# EasyEDA Pro project FKM3.epro, board PCB9
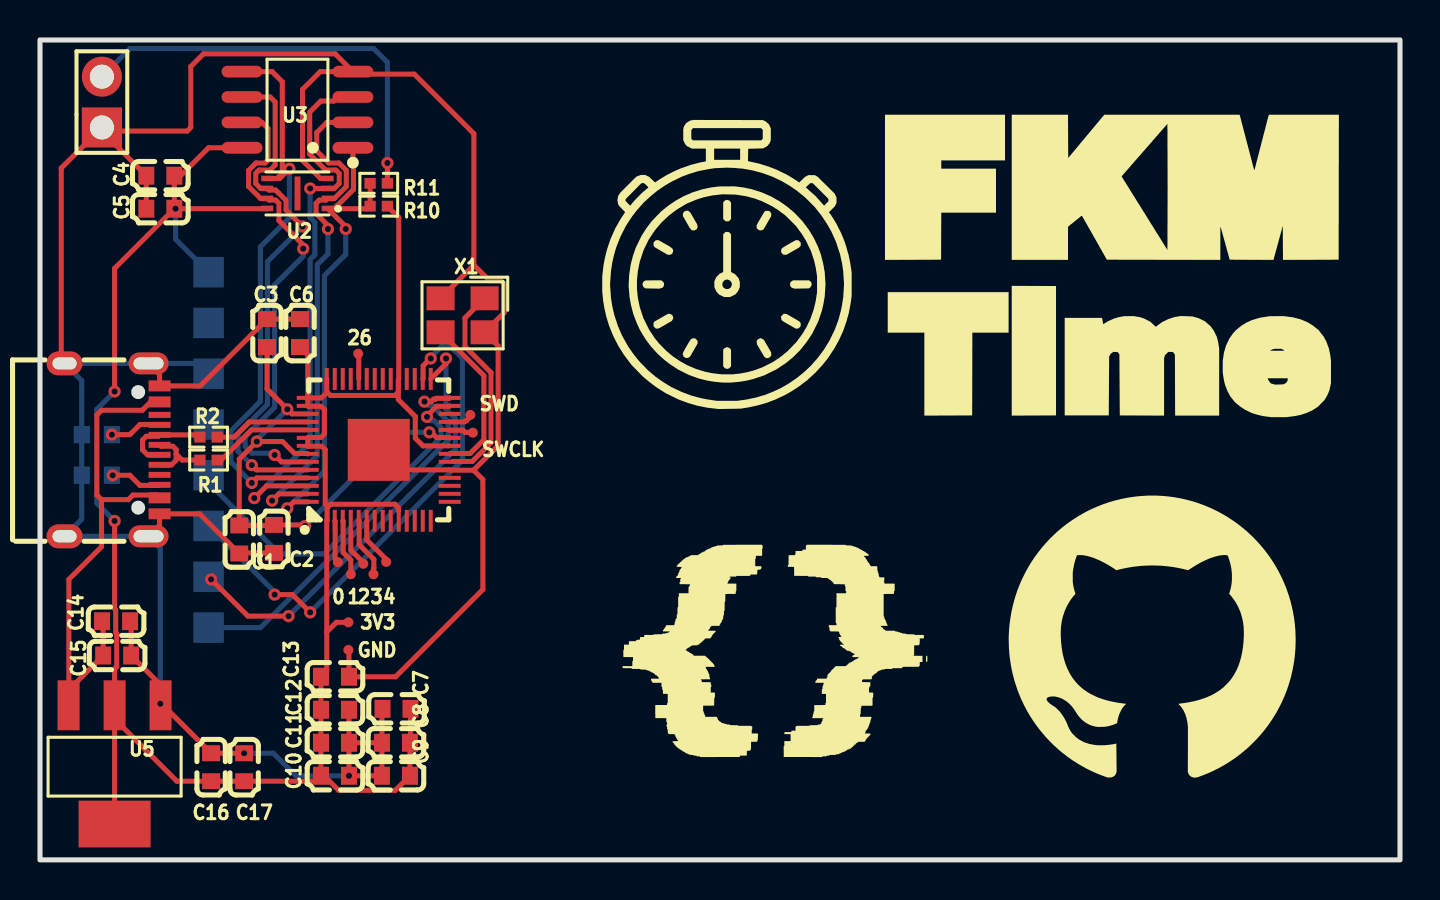
[diagram p15: board, top side]
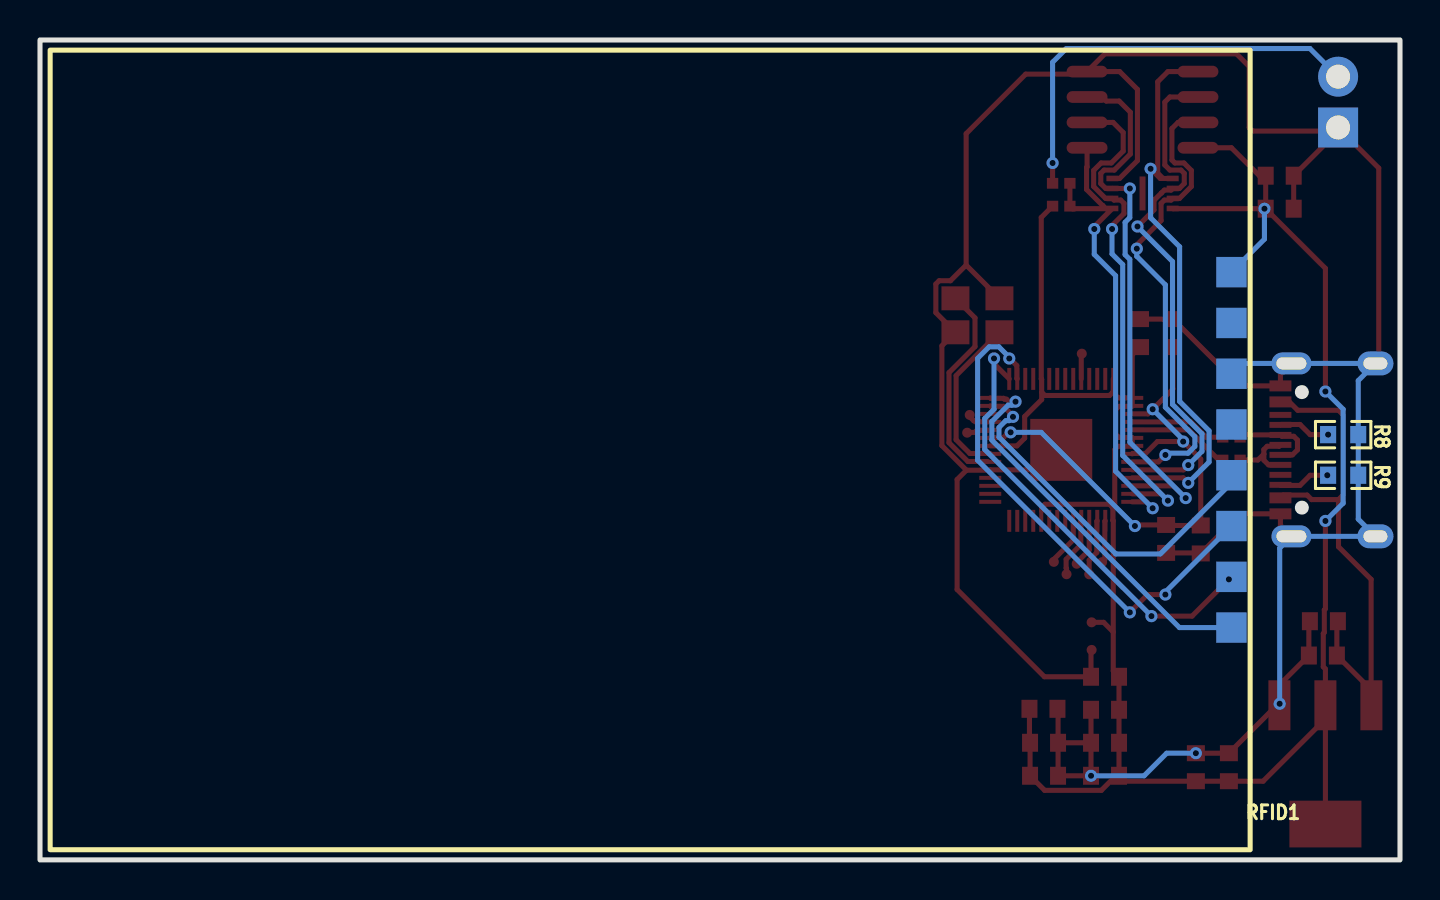
[diagram p16: board, bottom side, seen from below]

Outline 68 x 41.02 mm; copper layers: Top Layer, Bottom Layer. Coordinates in mm from the lower left corner of the outline.
Outline path: rectangle 0,41.02 68,0
Stack: Top Layer 0.035mm / Dielectric1 1.51mm FR4 er 4.5 / Bottom Layer 0.035mm

## Design rules (mm)
template: JLCPCB Capability(Two Layers Board)
spacing copperThickness1oz (default): track to track 0.102, other pairs 0.152 to 0.3
spacing copperThickness2oz: track to track 0.203, other pairs 0.152 to 0.3
track width copperThickness1oz (default): min 0.127, default 0.254, max 2.54
track width copperThickness2oz: min 0.203, default 0.254, max 2.54
differential pair differentialPair (default): width min 0.127, default 0.254, max 2.54; gap min 0.152, default 0.152
via viaSize (default): diameter min 0.5, default 0.61, max 10; hole min 0.3, default 0.305, max 6.3

## Placement (name value [footprint] x y rotation side)
0  -  [Test-Point-0.5mm]  14.89 14.89 0 top
1  -  [Test-Point-0.5mm]  15.54 14.29 0 top
2  -  [Test-Point-0.5mm]  16.17 14.81 0 top
3  -  [Test-Point-0.5mm]  16.67 14.29 0 top
3V3  -  [Test-Point-0.5mm]  15.42 11.88 0 top
4  -  [Test-Point-0.5mm]  17.31 14.91 0 top
26  -  [Test-Point-0.5mm]  15.91 25.32 0 top
C1  100nF  [C0603]  9.96 16.03 270 top
C2  100nF  [C0603]  11.69 16.06 270 top
C3  1uF  [C0603]  11.35 26.35 90 top
C4  100nF  [C0603]  6.02 34.23 0 top
C5  100nF  [C0603]  6.02 32.58 0 top
C6  1uF  [C0603]  13 26.35 270 top
C7  100nF  [C0603]  17.83 7.56 180 top
C8  100nF  [C0603]  17.8 5.86 180 top
C9  100nF  [C0603]  17.8 4.21 180 top
C10  100nF  [C0603]  14.75 4.21 0 top
C11  100nF  [C0603]  14.75 5.86 0 top
C12  100nF  [C0603]  14.75 7.51 0 top
C13  100nF  [C0603]  14.75 9.16 0 top
C14  100nF  [C0603]  3.81 11.94 180 top
C15  10uF  [C0603]  3.86 10.22 180 top
C16  100nF  [C0603]  8.56 4.64 270 top
C17  10uF  [C0603]  10.21 4.64 270 top
GND  -  [Test-Point-0.5mm]  15.42 10.5 0 top
H1  PZ254V-11-02P  [HDR-TH_2P-P2.54-V-M]  3.09 37.91 90 top
R1  27.4Ω  [R0402]  8.43 20 180 top
R2  27.4Ω  [R0402]  8.43 21.15 180 top
R8  5100  [R0603]  2.84 21.27 0 bottom
R9  5100  [R0603]  2.84 19.24 0 bottom
R10  1kΩ  [R0402]  16.94 32.7 0 top
R11  1kΩ  [R0402]  16.94 33.85 180 top
RFID1  -  [RFID-RC522-Board]  12.75 58.99 0 bottom
SWCLK  -  [Test-Point-0.5mm]  21.64 21.37 0 top
SWD  -  [Test-Point-0.5mm]  21.51 22.26 0 top
U1  RP2040  [LQFN-56_L7.0-W7.0-P0.4-EP]  16.94 20.51 90 top
U2  W25Q16JVUXIQ  [USON-8_L3.0-W2.0-P0.50-BL-EP]  12.87 33.34 90 top
U3  AT25SF041B-SSHD-T  [SOIC-8_L4.9-W3.9-P1.27-LS6.0-BL]  12.87 37.53 90 top
U5  AMS1117-3.3  [SOT-223-3_L6.5-W3.4-P2.30-LS7.0-BR]  3.73 4.76 90 top
USB1  TYPE-C 16PIN 2MD(073)  [USB-C-SMD_TYPE-C-6PIN-2MD-073]  3.6 20.51 270 top
X1  12MHz  [CRYSTAL-SMD_4P-L3.2-W2.5-BL]  21.13 27.24 180 top

## Footprints (pads in the part's own frame, mm; a bottom-side part is the same pattern mirrored in y, then rotated)
C0603
  rect 0.8x0.9 smd: 1(-0.7,0) 2(0.7,0)
CRYSTAL-SMD_4P-L3.2-W2.5-BL
  rect 1.4x1.2 smd: 1(-1.1,-0.85) 2(1.1,-0.85) 3(1.1,0.85) 4(-1.1,0.85)
HDR-TH_2P-P2.54-V-M
  rect 2x2 hole 1.2: 1(-1.27,0)
  round 2 hole 1.2: 2(1.27,0)
LQFN-56_L7.0-W7.0-P0.4-EP
  rect 1.1x0.2 smd: 1(-3.55,2.6) 2(-3.55,2.2) 3(-3.55,1.8) 4(-3.55,1.4) 5(-3.55,1) 6(-3.55,0.6) 7(-3.55,0.2) 8(-3.55,-0.2) 9(-3.55,-0.6) 10(-3.55,-1) 11(-3.55,-1.4) 12(-3.55,-1.8) 13(-3.55,-2.2) 14(-3.55,-2.6) 29(3.55,-2.6) 30(3.55,-2.2) 31(3.55,-1.8) 32(3.55,-1.4) 33(3.55,-1) 34(3.55,-0.6) 35(3.55,-0.2) 36(3.55,0.2) 37(3.55,0.6) 38(3.55,1) 39(3.55,1.4) 40(3.55,1.8) 41(3.55,2.2) 42(3.55,2.6)
  rect 0.2x1.1 smd: 15(-2.6,-3.55) 16(-2.2,-3.55) 17(-1.8,-3.55) 18(-1.4,-3.55) 19(-1,-3.55) 20(-0.6,-3.55) 21(-0.2,-3.55) 22(0.2,-3.55) 23(0.6,-3.55) 24(1,-3.55) 25(1.4,-3.55) 26(1.8,-3.55) 27(2.2,-3.55) 28(2.6,-3.55) 43(2.6,3.55) 44(2.2,3.55) 45(1.8,3.55) 46(1.4,3.55) 47(1,3.55) 48(0.6,3.55) 49(0.2,3.55) 50(-0.2,3.55) 51(-0.6,3.55) 52(-1,3.55) 53(-1.4,3.55) 54(-1.8,3.55) 55(-2.2,3.55) 56(-2.6,3.55)
  rect 3.1x3.1 smd: 57(0,0)
R0402
  rect 0.566x0.54 smd: 1(-0.433,0) 2(0.433,0)
R0603
  rect 0.806x0.864 smd: 1(-0.753,0) 2(0.753,0)
RFID-RC522-Board
  rect 1.524x1.524 smd: 1(-4.318,47.371) 2(-4.318,44.831) 3(-4.318,42.291) 4(-4.318,39.751) 5(-4.318,37.211) 6(-4.318,34.671) 7(-4.318,32.131) 8(-4.318,29.591)
SOIC-8_L4.9-W3.9-P1.27-LS6.0-BL
  oval 0.588x2.045 smd: 1(-1.905,-2.772) 2(-0.635,-2.772) 3(0.635,-2.772) 4(1.905,-2.772) 5(1.905,2.772) 6(0.635,2.772) 7(-0.635,2.772) 8(-1.905,2.772)
SOT-223-3_L6.5-W3.4-P2.30-LS7.0-BR
  rect 2.5x1.1 smd: 1(2.97,-2.3) 2(2.97,0) 3(2.97,2.3)
  rect 2.34x3.6 smd: 4(-2.97,0)
Test-Point-0.5mm
  round 0.5 smd: 1(0,0)
USB-C-SMD_TYPE-C-6PIN-2MD-073
  rect 0.55x1.1 smd: 1(-3.2,2.375) 2(-2.4,2.375) 11(2.4,2.375) 12(3.2,2.375)
  rect 0.3x1.1 smd: 3(-1.75,2.375) 4(-1.25,2.375) 5(-0.75,2.375) 6(-0.25,2.375) 7(0.25,2.375) 8(0.75,2.375) 9(1.25,2.375) 10(1.75,2.375)
  oval 1.1x2 hole 0.6x1.5: 13(-4.325,1.825) 14(4.325,1.825)
  oval 1.2x1.8 hole 0.6x1.2: 13(-4.325,-2.375) 14(4.325,-2.375)
USON-8_L3.0-W2.0-P0.50-BL-EP
  rect 0.28x0.6 smd: 1(-0.75,-1.508) 2(-0.25,-1.508) 3(0.25,-1.508) 4(0.75,-1.508) 5(0.75,1.508) 6(0.25,1.508) 7(-0.25,1.508) 8(-0.75,1.508)
  rect 1.7x0.3 smd: 9(0,0)

## Nets
+1V1: C1.1 C2.1 C3.1 U1.23 U1.45 U1.50
+3V3: 3V3.1 C4.2 C5.2 C6.2 C7.1 C8.1 C9.1 C10.1 C11.1 C12.1 C13.1 C16.2 C17.2 R10.2 RFID1.8 U1.1 U1.10 U1.22 U1.33 U1.42 U1.43 U1.44 U1.48 U1.49 U2.8 U3.8 U5.2 U5.4
GND: C1.2 C2.2 C3.2 C4.1 C5.1 C6.1 C7.2 C8.2 C9.2 C10.2 C11.2 C12.2 C13.2 C14.1 C15.1 C16.1 C17.1 GND.1 H1.1 R8.1 R9.1 RFID1.6 U1.19 U1.57 U2.4 U3.4 U5.1 USB1.1 USB1.12 USB1.13 USB1.14 X1.2 X1.4
GPIO0: 0.1 U1.2
GPIO1: 1.1 U1.3
GPIO2: 2.1 U1.4
GPIO3: 3.1 U1.5
GPIO4: 4.1 U1.6
GPIO26: 26.1 U1.38
IRQ: U1.31
QSPI_SCLK: U1.52 U2.6 U3.6
QSPI_SD0: U1.53 U2.5 U3.5
QSPI_SD1: U1.55 U2.2 U3.2
QSPI_SD2: U1.54 U2.3 U3.3
QSPI_SD3: U1.51 U2.7 U3.7
QSPI_SS: R10.1 R11.2 U1.56 U2.1 U3.1
SPI_CS: RFID1.1 U1.28
SPI_MISO: RFID1.4 U1.27
SPI_MOSI: RFID1.3 U1.30
SPI_SCK: RFID1.2 U1.29
SWCLK: SWCLK.1 U1.24
SWD: SWD.1 U1.25
USB_DM: R2.2 USB1.5 USB1.7
USB_DP: R1.2 USB1.6 USB1.8
VUSB: C14.2 C15.2 U5.3 USB1.2 USB1.11
XIN: U1.20 X1.1
XOUT: U1.21 X1.3
$1N1062: R1.1 U1.47
$1N1101: R2.1 U1.46
$1N1888: R8.2 USB1.4
$1N1892: R9.2 USB1.10
$1N2947: H1.2 R11.1

Pads without a net: RFID1 5 7; U1 7 8 9 11 12 13 14 15 16 17 18 26 32 34 35 36 37 39 40 41; U2 9; USB1 3 9

## Via types
v1: diameter 0.61, hole 0.305, Top Layer to Bottom Layer, 33 vias

## Routing (per net, layer and track width the routed paths; a pad name or vN(x,y) marks a point on that pad's centre or on a via; arc(x,y) is an arc through that point)
+1V1: length 26.9
  Top Layer w0.254: v1(19.47,21.39) 19.57,21.39 19.82,21.13 20.47,21.13 U1.23 ; C3.1 11.35,23.56 v1(12.37,22.54) 12.6,22.31 U1.45 ; v1(13.25,16.7) 13.2,16.76 C2.1 11.67,16.73 C1.1 9.96,20.05 v1(10.84,20.93) 12.13,20.93 12.72,20.33 13.37,20.33 U1.50
  Bottom Layer w0.254: v1(10.84,20.93) 10.84,21.02 v1(12.37,22.54) ; v1(19.47,21.39) 17.94,21.39 v1(13.25,16.7)
+3V3: length 115.1
  Top Layer w0.254: 17.92,23.4 17.75,23.23 14.52,23.23 14.38,23.37 14.34,23.37 ; 17.92,23.4 17.92,24.04 U1.33 17.94,32.14 R10.2 ; 17.92,23.4 17.92,23.03 18.77,22.18 18.77,21.09 19.15,20.71 U1.22 ; 14.34,23.37 14.34,24.06 ; 14.34,23.37 14.08,23.11 U1.43 ; v1(6.78,32.58) 11.35,32.58 U2.8 ; v1(6.78,32.58) C5.2 3.73,29.59 v1(3.73,23.43) ; v1(6.78,32.58) 6.72,32.64 C4.2 7.03,34.23 8.43,35.62 U3.8 ; C6.2 13.39,25.27 U1.43 ; 17.92,17.46 17.92,17.63 17.75,17.79 14.52,17.79 14.4,17.67 ; C7.1 18.53,5.89 C8.1 C9.1 17.77,3.48 14.93,3.48 14.2,4.21 C10.1 ; 3.73,1.79 3.73,7.05 6.84,3.94 C16.2 C17.2 13.78,3.94 C10.1 ; v1(3.73,16.95) 3.73,12.56 3.78,12.51 3.78,11.37 3.84,11.32 3.84,9.66 3.73,9.55 U5.2 ; C10.1 C11.1 C12.1 C13.1 14.34,9.45 14.34,11.4 ; U1.43 U1.44 13.41,22.69 14.05,22.69 14.22,22.53 14.22,21.3 14.05,21.13 13.41,21.13 U1.48 U1.49 13.41,20.69 14.09,20.69 14.26,20.52 14.26,17.8 14.4,17.67 ; 14.4,17.67 14.36,17.63 14.36,16.98 14.34,16.96 14.34,11.4 ; 14.34,11.4 14.82,11.88 3V3.1
  Bottom Layer w0.254: v1(3.73,23.43) 2.84,22.54 2.84,17.84 v1(3.73,16.95) ; v1(6.78,32.58) 6.78,31.05 RFID1.8
GND: length 164.9
  Top Layer w0.254: 21.68,19.49 22.91,20.72 22.91,25.71 X1.4 22.23,26.4 23.21,27.38 23.21,28.81 23.04,28.97 22.48,28.97 21.69,29.76 ; 21.68,19.49 22.15,19.03 22.15,13.53 17.78,9.16 C13.2 15.45,10.53 GND.1 ; 21.68,19.49 20.5,19.49 U1.19 17.94,19.51 U1.57 ; H1.1 3.09,36.45 C4.1 C5.1 ; H1.1 1.06,34.61 1.06,25 USB1.13 ; H1.1 3.27,36.46 7.36,36.46 7.54,36.64 7.54,39.69 8.17,40.32 14.76,40.32 U3.4 ; C8.2 17.1,7.49 17.08,7.51 C7.2 ; C8.2 C9.2 15.69,4.21 15.45,4.45 C11.2 ; C8.2 C11.2 ; C12.2 C11.2 ; C6.1 C3.2 8.01,23.71 USB1.1 5.98,24.29 USB1.13 ; U3.4 15.77,39.31 18.72,39.31 21.69,36.33 21.69,29.76 ; U3.4 14.02,39.43 13.13,38.54 13.13,34.98 14.02,34.09 U2.4 ; C2.2 9.99,15.36 C1.2 7.98,17.31 USB1.12 5.98,16.74 USB1.14 ; 21.69,29.76 X1.2 ; v1(10.21,5.34) C16.1 6.16,7.73 U5.1 6.03,8.75 C15.1 4.56,11.89 C14.1
  Bottom Layer w0.254: v1(10.21,5.34) 11.67,5.34 12.79,4.21 v1(15.45,4.21) ; v1(6.02,7.81) 6.02,15.6 USB1.14 USB1.14 2.09,17.05 R9.1 R8.1 2.09,23.98 USB1.13 USB1.13 7.91,24.84 RFID1.6
GPIO0: length 2.1
  Top Layer w0.254: U1.2 14.76,16.94 14.76,15.03 0.1
GPIO1: length 2.8
  Top Layer w0.254: 1.1 15.54,15 15.16,15.38 15.16,16.94 U1.3
GPIO2: length 1.9
  Top Layer w0.254: 15.54,16.45 15.54,15.5 16.17,14.88 2.1
GPIO3: length 3
  Top Layer w0.254: U1.5 15.96,16.94 15.96,15.77 16.69,15.03 16.69,14.59 16.67,14.57 3.1
GPIO4: length 2.3
  Top Layer w0.254: 16.34,16.96 16.34,16.01 17.31,15.04
GPIO26: length 1.3
  Top Layer w0.254: U1.38 15.94,25.3 26.1
QSPI_SCLK: length 26.5
  Top Layer w0.254: U1.52 10.83,19.51 v1(10.59,19.75) ; U3.6 11.5,38.16 11.76,37.91 11.76,34.76 11.5,34.51 10.95,34.51 10.79,34.34 10.79,33.83 11.03,33.59 U2.6 11.45,33.51 11.78,33.51 11.93,33.36 11.93,33.36 12.3,32.99 12.3,32.51 v1(13.13,31.69)
  Bottom Layer w0.254: v1(13.13,31.69) 11.38,29.93 11.38,22.79 9.9,21.32 9.9,20.43 v1(10.59,19.75)
QSPI_SD0: length 28.7
  Top Layer w0.254: 11.85,34.09 12.11,34.36 12.11,38.92 11.6,39.43 U3.5 ; 11.85,34.09 U2.5 ; 11.85,34.09 11.99,34.09 v1(12.47,34.57) ; v1(10.59,18.86) 10.84,19.11 U1.53
  Bottom Layer w0.254: v1(10.59,18.86) 9.55,19.9 9.55,21.46 11.02,22.94 11.02,30.67 12.47,32.12 v1(12.47,34.57)
QSPI_SD1: length 25.7
  Top Layer w0.254: U3.2 14.35,36.89 13.84,36.39 13.84,35.46 14.43,34.86 14.94,34.86 15.32,34.49 15.32,33.68 14.72,33.09 U2.2 14.3,33.01 13.97,33.01 13.8,32.84 13.8,32.33 14.38,31.75 14.38,31.58 v1(14.4,31.56) ; v1(11.6,17.97) 11.94,18.31 U1.55
  Bottom Layer w0.254: v1(11.6,17.97) 13.86,20.23 13.86,29.78 14.4,30.31 v1(14.4,31.56)
QSPI_SD2: length 28.3
  Top Layer w0.254: v1(10.72,18.1) 11.33,18.71 U1.54 ; U3.3 14.89,38.16 14.69,37.96 14.04,37.96 13.48,37.4 13.48,35.31 14.29,34.51 14.8,34.51 14.96,34.34 14.96,33.83 14.72,33.59 U2.3 v1(13.51,33.59)
  Bottom Layer w0.254: v1(10.72,18.1) 13.51,20.89 13.51,30.04 13.74,30.28 13.74,31.9 13.51,32.13 v1(13.51,33.59)
QSPI_SD3: length 24.2
  Top Layer w0.254: v1(13.16,30.58) 13.16,30.77 11.95,31.98 11.95,32.84 11.78,33.01 11.45,33.01 U2.7 11.03,33.09 10.43,33.68 10.43,34.49 10.8,34.86 11.26,34.86 11.4,35.01 11.4,36.59 11.1,36.89 U3.7 ; v1(11.73,20.26) 12.08,19.91 U1.51
  Bottom Layer w0.254: v1(11.73,20.26) 11.64,20.34 10.6,20.34 10.26,20.68 10.26,21.17 11.73,22.64 11.73,28.77 13.16,30.19 v1(13.16,30.58)
QSPI_SS: length 24.5
  Top Layer w0.254: 14.7,32.58 16.38,32.58 R10.1 R11.2 ; 14.7,32.58 14.86,32.73 14.87,32.73 15.67,33.54 15.67,34.64 15.65,34.66 U3.1 ; 14.7,32.58 14.39,32.58 ; 14.39,32.58 15.29,31.68 v1(15.29,31.56) ; 14.39,32.58 U2.1 ; U1.56 12.69,17.91 v1(12.37,17.59)
  Bottom Layer w0.254: v1(12.37,17.59) 14.22,19.44 14.22,29.22 15.29,30.29 v1(15.29,31.56)
SPI_CS: length 19.7
  Top Layer w0.254: v1(19.22,22.92) 19.55,22.92 19.68,23.05 19.78,23.05 19.82,23.09 20.47,23.09 U1.28
  Bottom Layer w0.254: RFID1.1 11.03,11.62 20.41,21 20.41,21.93 19.59,22.75 19.4,22.75 v1(19.22,22.92)
SPI_MISO: length 18.7
  Top Layer w0.254: v1(19.35,22.16) 19.35,22.22 19.82,22.69 20.47,22.69 U1.27
  Bottom Layer w0.254: RFID1.4 8.43,18.86 11.98,15.3 14.21,15.3 20.05,21.15 20.05,21.63 19.71,21.97 19.54,21.97 v1(19.35,22.16)
SPI_MOSI: length 26.1
  Top Layer w0.254: v1(19.54,25.08) 19.52,25.08 19.16,24.73 19.16,24.08 U1.30 ; v1(13.51,12.38) 12.62,13.27 v1(11.73,13.27)
  Bottom Layer w0.254: v1(11.73,13.27) 11.73,13.4 RFID1.3 ; v1(13.51,12.38) 21.12,19.99 21.12,25.09 20.54,25.67 20.06,25.67 19.54,25.15 v1(19.54,25.08)
SPI_SCK: length 22.5
  Top Layer w0.254: v1(12.43,12.19) 10.4,12.19 v1(8.56,14.03) ; U1.29 20.3,24.82 v1(20.3,25.08)
  Bottom Layer w0.254: v1(12.43,12.19) 20.76,20.53 20.76,22.08 20.3,22.54 v1(20.3,25.08)
SWCLK: length 1.1
  Top Layer w0.254: 21.51,21.38 21.26,21.38 21.15,21.49 20.51,21.49 U1.24
SWD: length 1.1
  Top Layer w0.254: U1.25 21.21,21.91 21.27,21.97 21.32,21.97 21.51,22.16
USB_DM: length 4.5
  Top Layer w0.254: R2.2 7.88,21.26 USB1.5 5.91,21.19 5.31,21.19 5.13,21 5.13,20.51 5.38,20.26 USB1.7
USB_DP: length 3.7
  Top Layer w0.254: 6.81,20.3 6.81,20.53 6.64,20.69 6.05,20.69 USB1.6 ; 6.81,20.3 6.81,20 6.57,19.76 USB1.8 ; 6.81,20.3 7.11,20 R1.2
VUSB: length 25.9
  Top Layer w0.254: USB1.2 5.53,22.91 5.11,22.49 3.08,22.49 2.84,22.26 2.84,18.26 3.08,18.02 ; U5.3 1.43,8.5 1.44,8.51 ; 1.44,8.51 C15.2 3.16,11.89 C14.2 ; 1.44,8.51 1.44,14.03 3.08,15.67 3.08,18.02 ; USB1.11 5.84,18.25 4.65,18.25 4.42,18.02 3.08,18.02
XIN: length 10.5
  Top Layer w0.254: 20.62,19.93 21.61,19.93 22.55,20.87 22.55,24.38 21.25,25.68 21.25,27.11 X1.1
XOUT: length 8.3
  Top Layer w0.254: U1.21 20.51,20.33 21.51,20.33 22.19,21.02 22.19,24.23 X1.3
$1N1062: length 5.2
  Top Layer w0.254: 8.86,20 9.06,20 10.57,21.51 U1.47
$1N1101: length 4.8
  Top Layer w0.254: U1.46 13.39,21.91 10.46,21.91 9.7,21.15 8.86,21.15
$1N1888: length 2.6
  Top Layer w0.254: v1(3.59,21.27) 4.49,21.27 5,21.78 5.96,21.78 USB1.4
$1N1892: length 2.6
  Top Layer w0.254: R9.2 4.49,19.24 5,18.73 5.95,18.73 USB1.10
  vias: v1(3.64,19.24)
$1N2947: length 21.2
  Top Layer w0.254: R11.1 v1(17.37,34.86)
  Bottom Layer w0.254: v1(17.37,34.86) 17.37,39.9 16.68,40.59 4.5,40.59 H1.2
